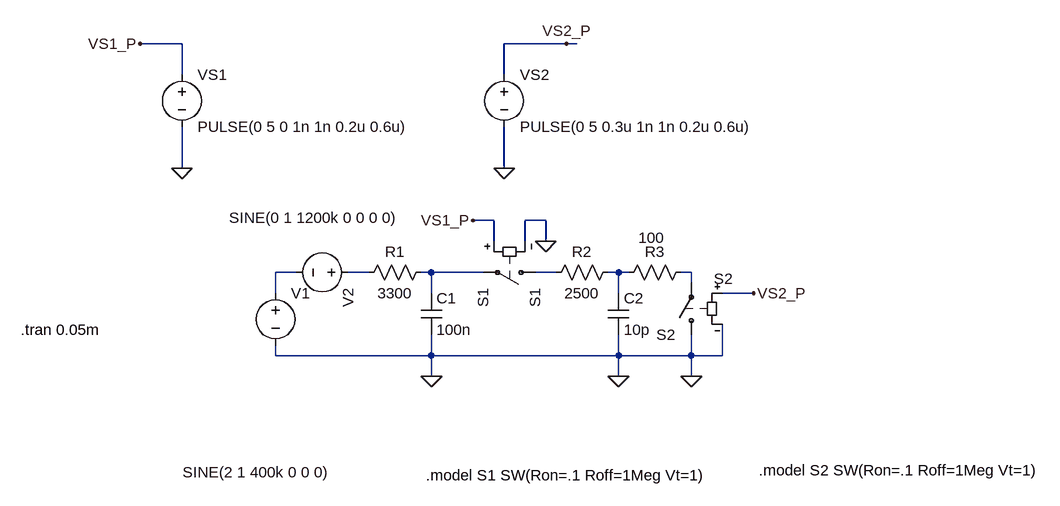
[diagram p0: schematic SAR_ADC_SIMULATION.asc]
SAR_ADC_SIMULATION.asc, the LTspice schematic file:
Version 4
SHEET 1 1052 680
WIRE -304 -256 -368 -256
WIRE 288 -256 192 -256
WIRE 304 -256 288 -256
WIRE -304 -208 -304 -256
WIRE 192 -208 192 -256
WIRE -304 -64 -304 -128
WIRE 192 -64 192 -128
WIRE 176 16 144 16
WIRE 256 16 224 16
WIRE 176 48 176 16
WIRE 224 48 224 16
WIRE 256 48 256 16
WIRE -128 96 -160 96
WIRE -16 96 -48 96
WIRE 80 96 64 96
WIRE 160 96 80 96
WIRE 272 96 240 96
WIRE 368 96 352 96
WIRE 384 96 368 96
WIRE 480 96 464 96
WIRE 480 112 480 96
WIRE -160 128 -160 96
WIRE 80 128 80 96
WIRE 368 128 368 96
WIRE 576 128 528 128
WIRE -160 224 -160 208
WIRE 80 224 80 192
WIRE 80 224 -160 224
WIRE 368 224 368 192
WIRE 368 224 80 224
WIRE 480 224 480 192
WIRE 480 224 368 224
WIRE 528 224 528 176
WIRE 528 224 480 224
WIRE 80 256 80 224
WIRE 368 256 368 224
WIRE 480 256 480 224
FLAG 480 256 0
FLAG 368 256 0
FLAG 80 256 0
FLAG -304 -64 0
FLAG 192 -64 0
FLAG 288 -256 VS2_P
FLAG -368 -256 VS1_P
FLAG 256 48 0
FLAG 576 128 VS2_P
FLAG 144 16 VS1_P
SYMBOL res 80 80 R90
WINDOW 0 0 56 VBottom 2
WINDOW 3 32 56 VTop 2
SYMATTR InstName R1
SYMATTR Value 3300
SYMBOL res 368 80 R90
WINDOW 0 0 56 VBottom 2
WINDOW 3 32 56 VTop 2
SYMATTR InstName R2
SYMATTR Value 2500
SYMBOL cap 64 128 R0
SYMATTR InstName C1
SYMATTR Value 100n
SYMBOL cap 352 128 R0
SYMATTR InstName C2
SYMATTR Value 10p
SYMBOL sw 256 96 R90
SYMATTR InstName S1
SYMATTR Value S1
SYMBOL sw 480 208 R180
WINDOW 3 -64 102 Left 2
SYMATTR InstName S2
SYMATTR Value S2
SYMBOL voltage -160 112 R0
WINDOW 3 -143 291 Left 2
WINDOW 123 0 0 Left 0
WINDOW 39 0 0 Left 0
SYMATTR InstName V1
SYMATTR Value SINE(2 1 400k 0 0 0)
SYMBOL voltage -32 96 R90
WINDOW 3 -84 -60 VRight 2
WINDOW 123 0 0 Left 0
WINDOW 39 0 0 Left 0
SYMATTR InstName V2
SYMATTR Value SINE(0 1 1200k 0 0 0 0)
SYMBOL voltage -304 -224 R0
WINDOW 123 0 0 Left 0
WINDOW 39 0 0 Left 0
SYMATTR InstName VS1
SYMATTR Value PULSE(0 5 0 1n 1n 0.2u 0.6u)
SYMBOL voltage 192 -224 R0
WINDOW 123 0 0 Left 0
WINDOW 39 0 0 Left 0
SYMATTR InstName VS2
SYMATTR Value PULSE(0 5 0.3u 1n 1n 0.2u 0.6u)
SYMBOL res 480 80 R90
WINDOW 0 0 56 VBottom 2
WINDOW 3 -53 61 VTop 2
SYMATTR InstName R3
SYMATTR Value 100
TEXT 72 408 Left 2 !.model S1 SW(Ron=.1 Roff=1Meg Vt=1)
TEXT 584 400 Left 2 !.model S2 SW(Ron=.1 Roff=1Meg Vt=1)
TEXT -552 184 Left 2 !.tran 0.05m

The netlist it stands for:
* SAR_ADC_SIMULATION.asc
R1 N003 N002 3300
R2 N005 N004 2500
C1 N003 0 100n
C2 N005 0 10p
S1 N004 N003 VS1_P 0 S1
S2 0 N006 VS2_P 0 S2
V1 N001 0 SINE(2 1 400k 0 0 0)
V2 N002 N001 SINE(0 1 1200k 0 0 0 0)
VS1 VS1_P 0 PULSE(0 5 0 1n 1n 0.2u 0.6u)
VS2 VS2_P 0 PULSE(0 5 0.3u 1n 1n 0.2u 0.6u)
R3 N006 N005 100
.model S1 SW(Ron=.1 Roff=1Meg Vt=1)
.model S2 SW(Ron=.1 Roff=1Meg Vt=1)
.tran 0.05m
.backanno
.end